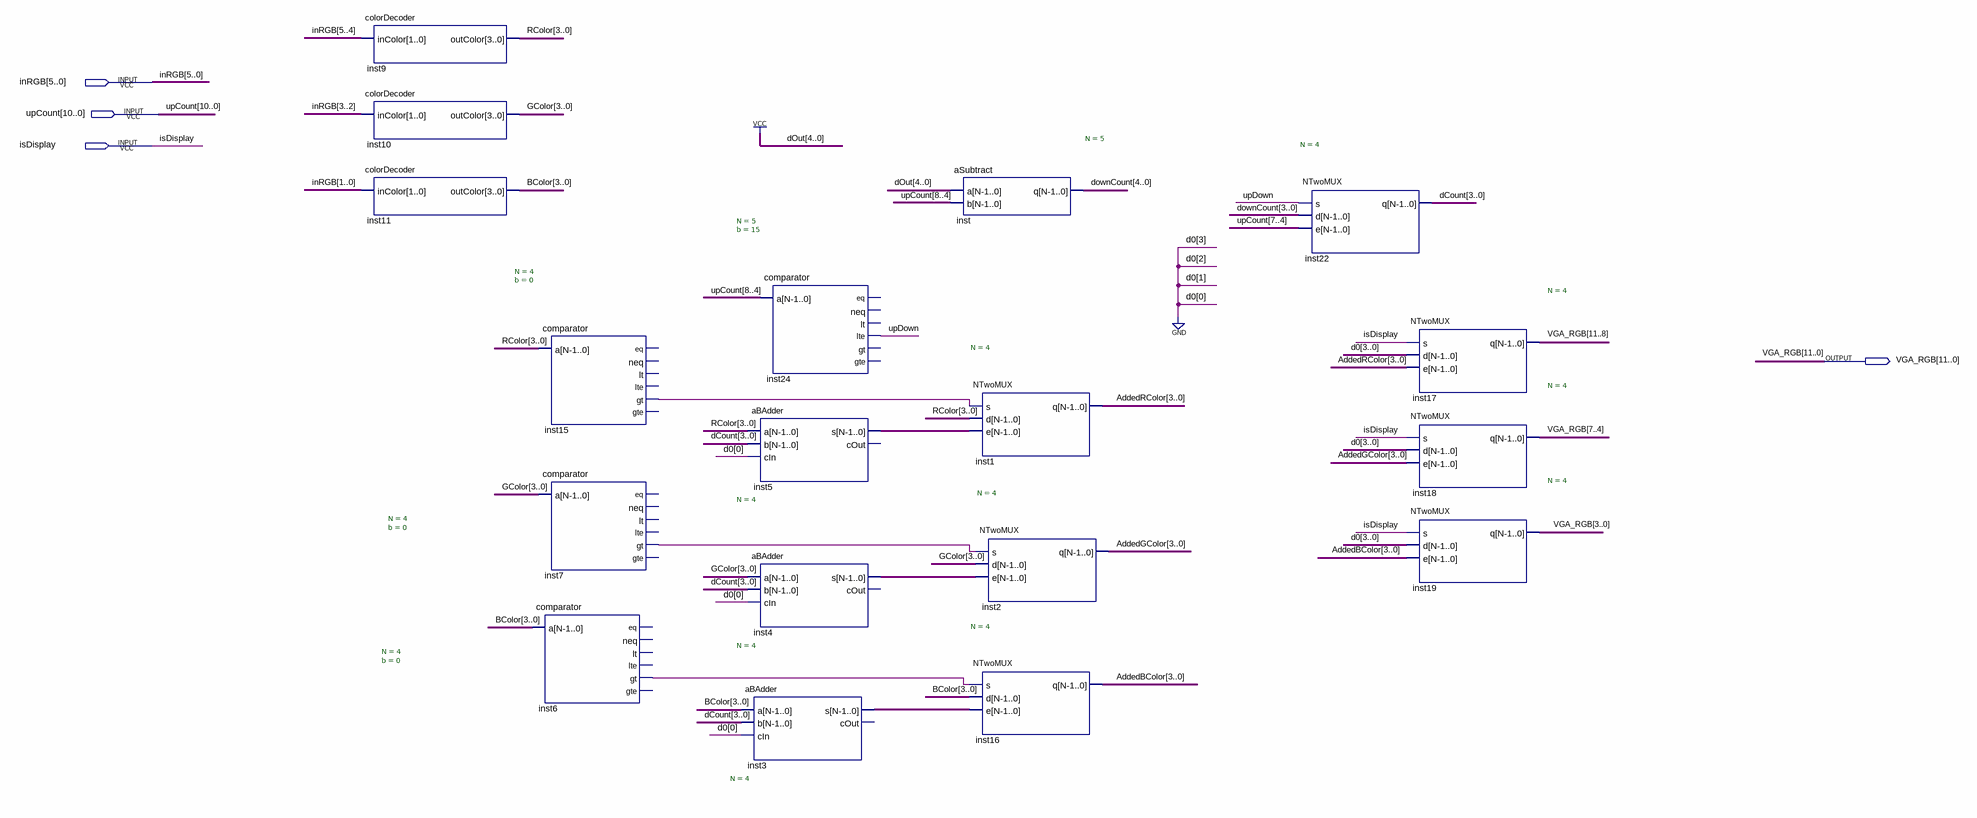
[diagram p0: schematic sheet]
// Quartus schematic backgroundModule.bdf as structural Verilog: 18 symbols, 4 pins
module backgroundModule (
  input  [5:0] inRGB,
  input  [10:0] upCount,
  input  isDisplay,
  output [11:0] VGA_RGB
);

  wire inst6_gt, inst7_gt, inst15_gt, upDown;
  wire [3:0] AddedBColor, AddedGColor, AddedRColor, BColor, dCount, GColor, inst3_s, inst4_s, inst5_s, RColor;
  wire [4:0] downCount;

  colorDecoder inst9 (.inColor(inRGB[5:4]), .outColor(RColor));
  colorDecoder inst10 (.inColor(inRGB[3:2]), .outColor(GColor));
  colorDecoder inst11 (.inColor(inRGB[1:0]), .outColor(BColor));
  comparator #(.N(4), .b(0)) inst15 (.a(RColor), .gt(inst15_gt));  // open: eq, neq, lt, lte, gte
  comparator #(.N(4), .b(0)) inst7 (.a(GColor), .gt(inst7_gt));  // open: eq, neq, lt, lte, gte
  comparator #(.N(4), .b(0)) inst6 (.a(BColor), .gt(inst6_gt));  // open: eq, neq, lt, lte, gte
  aBAdder #(.N(4)) inst3 (.a(BColor), .b(dCount), .cIn(1'b0), .s(inst3_s));  // open: cOut
  comparator #(.N(5), .b(15)) inst24 (.a(upCount[8:4]), .lte(upDown));  // open: eq, neq, lt, gt, gte
  aBAdder #(.N(4)) inst5 (.a(RColor), .b(dCount), .cIn(1'b0), .s(inst5_s));  // open: cOut
  aBAdder #(.N(4)) inst4 (.a(GColor), .b(dCount), .cIn(1'b0), .s(inst4_s));  // open: cOut
  aSubtract #(.N(5)) inst (.a({5{1'b1}}), .b(upCount[8:4]), .q(downCount));
  NTwoMUX #(.N(4)) inst1 (.s(inst15_gt), .d(RColor), .e(inst5_s), .q(AddedRColor));
  NTwoMUX #(.N(4)) inst2 (.s(inst7_gt), .d(GColor), .e(inst4_s), .q(AddedGColor));
  NTwoMUX #(.N(4)) inst16 (.s(inst6_gt), .d(BColor), .e(inst3_s), .q(AddedBColor));
  NTwoMUX #(.N(4)) inst22 (.s(upDown), .d(downCount[3:0]), .e(upCount[7:4]), .q(dCount));
  NTwoMUX #(.N(4)) inst17 (.s(isDisplay), .d(4'b0000), .e(AddedRColor), .q(VGA_RGB[11:8]));
  NTwoMUX #(.N(4)) inst18 (.s(isDisplay), .d(4'b0000), .e(AddedGColor), .q(VGA_RGB[7:4]));
  NTwoMUX #(.N(4)) inst19 (.s(isDisplay), .d(4'b0000), .e(AddedBColor), .q(VGA_RGB[3:0]));
endmodule
